# Altium project Test6502_project.PrjPcb
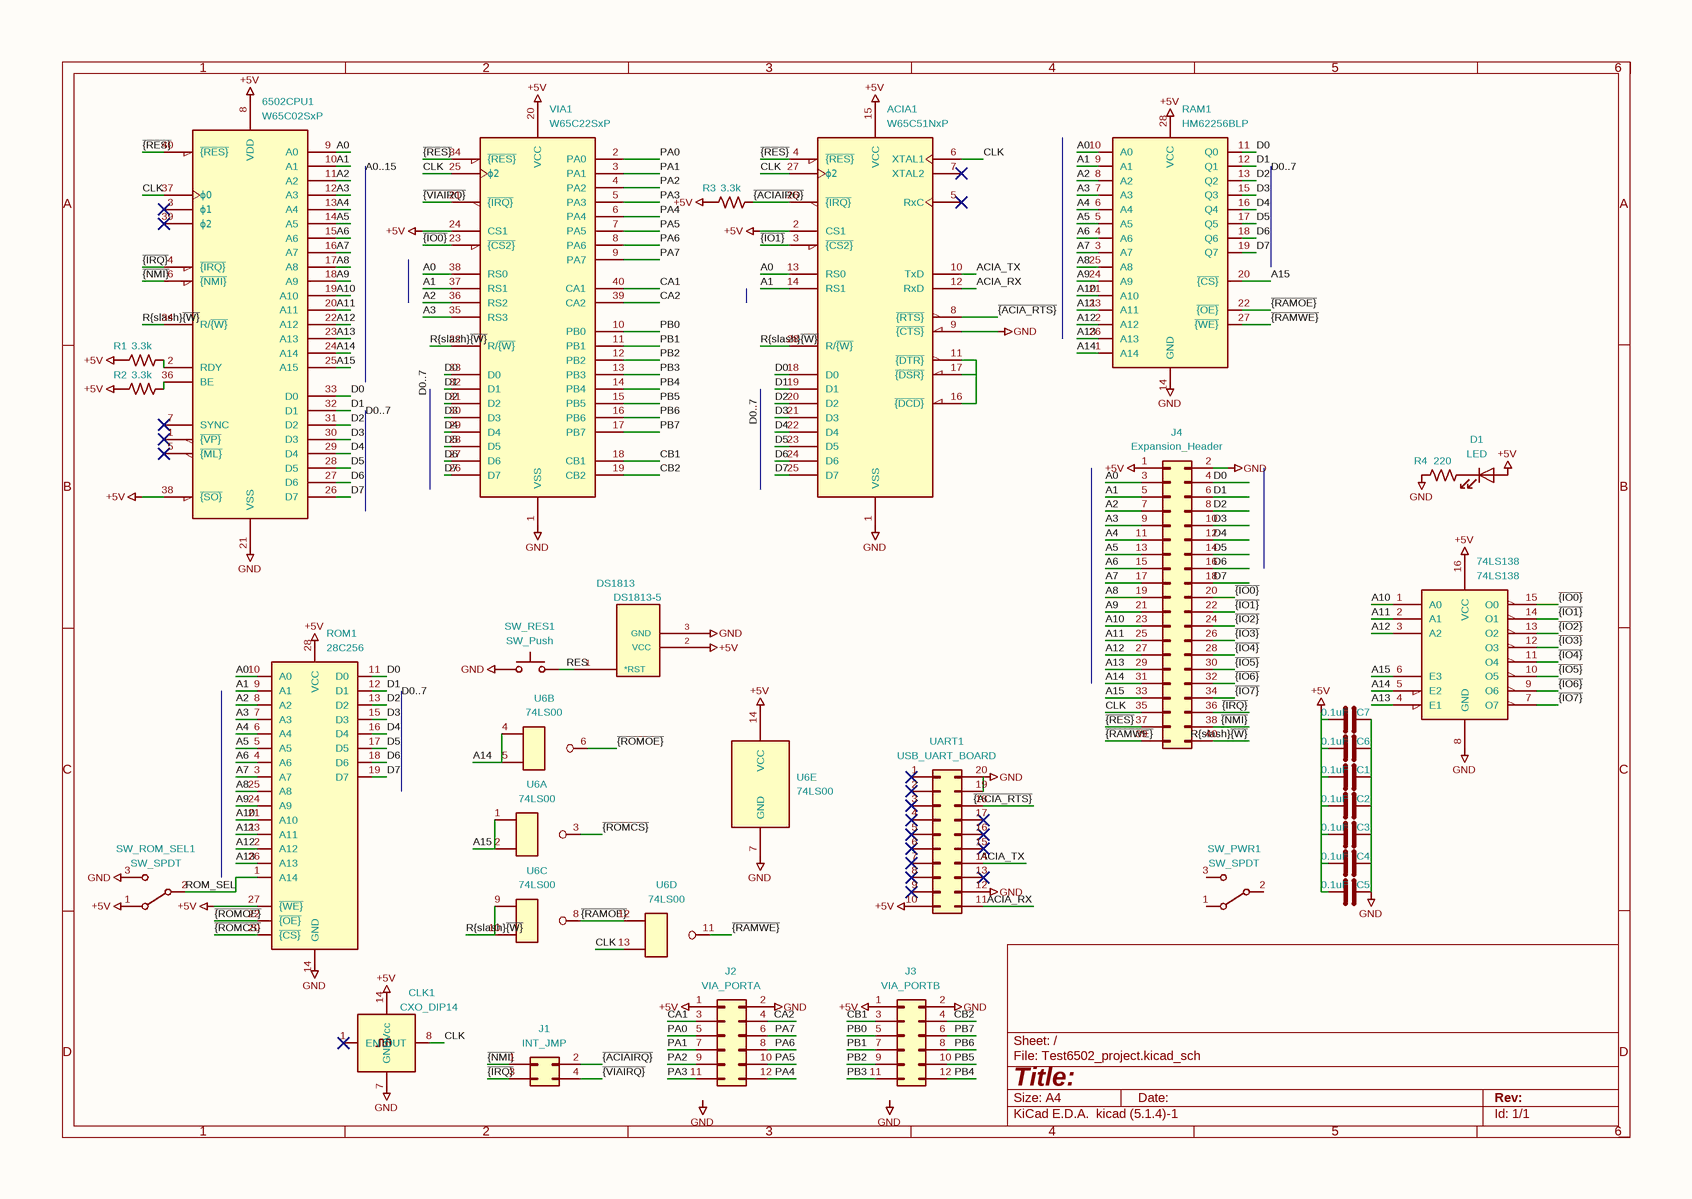
[diagram p0: Test6502_project.SchDoc]
1 sheet, 29 parts. Net scope: global (net labels, ports and power ports of the same name join across sheets).
Board files: Test6502_project.PcbDoc, Test6502_project(1).PcbDoc, Test6502_project_attempt_1.PcbDoc, Test6502_project_attempt_1(1).PcbDoc

## Sheet Test6502_project.SchDoc
size 297 x 209 mm

### Parts
74LS138  74LS138  [DIP-16_W7.62mm]
6502CPU1  W65C02SxP  [DIP-40_W15.24mm_Socket]
ACIA1  W65C51NxP  [DIP-28_W15.24mm_Socket]
C1  0.1uF  [C_Disc_D5.0mm_W2.5mm_P2.50mm]
C2  0.1uF  [C_Disc_D5.0mm_W2.5mm_P2.50mm]
C3  0.1uF  [C_Disc_D5.0mm_W2.5mm_P2.50mm]
C4  0.1uF  [C_Disc_D5.0mm_W2.5mm_P2.50mm]
C5  0.1uF  [C_Disc_D5.0mm_W2.5mm_P2.50mm]
C6  0.1uF  [C_Disc_D5.0mm_W2.5mm_P2.50mm]
C7  0.1uF  [C_Disc_D5.0mm_W2.5mm_P2.50mm]
CLK1  CXO_DIP14  [Oscillator_DIP-14]
D1  LED  [LED_D3.0mm]
DS1813  DS1813-5  [21-0248A]
J1  INT_JMP  [PinHeader_2x02_P2.54mm_Vertical]
J2  VIA_PORTA  [PinHeader_2x06_P2.54mm_Vertical]
J3  VIA_PORTB  [PinHeader_2x06_P2.54mm_Vertical]
J4  Expansion_Header  [PinHeader_2x20_P2.54mm_Vertical]
R1  3.3k  [R_Axial_DIN0207_L6.3mm_D2.5mm_P7.62mm_Horizontal]
R2  3.3k  [R_Axial_DIN0207_L6.3mm_D2.5mm_P7.62mm_Horizontal]
R3  3.3k  [R_Axial_DIN0207_L6.3mm_D2.5mm_P7.62mm_Horizontal]
R4  220  [R_Axial_DIN0207_L6.3mm_D2.5mm_P7.62mm_Horizontal]
RAM1  HM62256BLP  [DIP-28_W15.24mm_Socket]
ROM1  28C256  [DIP-28_W15.24mm_Socket]
SW_PWR1  SW_SPDT  [SW_THT_DPDT]
SW_RES1  SW_Push  [SW_PUSH_6mm]
SW_ROM_SEL1  SW_SPDT  [SW_THT_DPDT]
U6  74LS00  [DIP-14_W7.62mm]  (parts A,B,C,D,E of 5)
UART1  USB_UART_BOARD  [DIP-20_W15.24mm_UART]
VIA1  W65C22SxP  [DIP-40_W15.24mm_Socket]

### Nets
+5V: 74LS138.16(VCC) 6502CPU1.8(VDD) 6502CPU1.38(~{{SO}}) ACIA1.2(CS1) ACIA1.15(VCC) C1.1 C2.1 C3.1 C4.1 C5.1 C6.1 C7.1 CLK1.14(Vcc) D1.2(A) DS1813.2(VCC) J2.1(Pin_1) J3.1(Pin_1) J4.1(Pin_1) R1.1 R2.1 R3.1 RAM1.28(VCC) ROM1.27(~{{WE}}) ROM1.28(VCC) SW_ROM_SEL1.1(A) U6.14(VCC) UART1.10(Pin_10) VIA1.20(VCC) VIA1.24(CS1)
GND: 74LS138.8(GND) 6502CPU1.21(VSS) ACIA1.1(VSS) ACIA1.9(~{{CTS}}) C1.2 C2.2 C3.2 C4.2 C5.2 C6.2 C7.2 CLK1.7(GND) DS1813.3(GND) J2.2(Pin_2) J3.2(Pin_2) J4.2(Pin_2) R4.1 RAM1.14(GND) ROM1.14(GND) SW_RES1.1 SW_ROM_SEL1.3(C) U6.7(GND) UART1.12(Pin_12) UART1.19(Pin_19) UART1.20(Pin_20) VIA1.1(VSS)
A0: 6502CPU1.9(A0) ACIA1.13(RS0) J4.3(Pin_3) RAM1.10(A0) ROM1.10(A0) VIA1.38(RS0)
A1: 6502CPU1.10(A1) ACIA1.14(RS1) J4.5(Pin_5) RAM1.9(A1) ROM1.9(A1) VIA1.37(RS1)
A2: 6502CPU1.11(A2) J4.7(Pin_7) RAM1.8(A2) ROM1.8(A2) VIA1.36(RS2)
A3: 6502CPU1.12(A3) J4.9(Pin_9) RAM1.7(A3) ROM1.7(A3) VIA1.35(RS3)
A4: 6502CPU1.13(A4) J4.11(Pin_11) RAM1.6(A4) ROM1.6(A4)
A5: 6502CPU1.14(A5) J4.13(Pin_13) RAM1.5(A5) ROM1.5(A5)
A6: 6502CPU1.15(A6) J4.15(Pin_15) RAM1.4(A6) ROM1.4(A6)
A7: 6502CPU1.16(A7) J4.17(Pin_17) RAM1.3(A7) ROM1.3(A7)
A8: 6502CPU1.17(A8) J4.19(Pin_19) RAM1.25(A8) ROM1.25(A8)
A9: 6502CPU1.18(A9) J4.21(Pin_21) RAM1.24(A9) ROM1.24(A9)
A10: 74LS138.1(A0) 6502CPU1.19(A10) J4.23(Pin_23) RAM1.21(A10) ROM1.21(A10)
A11: 74LS138.2(A1) 6502CPU1.20(A11) J4.25(Pin_25) RAM1.23(A11) ROM1.23(A11)
A12: 74LS138.3(A2) 6502CPU1.22(A12) J4.27(Pin_27) RAM1.2(A12) ROM1.2(A12)
A13: 74LS138.4(E1) 6502CPU1.23(A13) J4.29(Pin_29) RAM1.26(A13) ROM1.26(A13)
A14: 74LS138.5(E2) 6502CPU1.24(A14) J4.31(Pin_31) RAM1.1(A14) U6.4 U6.5
A15: 74LS138.6(E3) 6502CPU1.25(A15) J4.33(Pin_33) RAM1.20(~{{CS}}) U6.1 U6.2
ACIA_RX: ACIA1.12(RxD) UART1.11(Pin_11)
ACIA_TX: ACIA1.10(TxD) UART1.14(Pin_14)
CA1: J2.3(Pin_3) VIA1.40(CA1)
CA2: J2.4(Pin_4) VIA1.39(CA2)
CB1: J3.3(Pin_3) VIA1.18(CB1)
CB2: J3.4(Pin_4) VIA1.19(CB2)
CLK: 6502CPU1.37(ϕ0) ACIA1.6(XTAL1) ACIA1.27(ϕ2) CLK1.8(OUT) J4.35(Pin_35) U6.13 VIA1.25(ϕ2)
D0: 6502CPU1.33(D0) ACIA1.18(D0) J4.4(Pin_4) RAM1.11(Q0) ROM1.11(D0) VIA1.33(D0)
D1: 6502CPU1.32(D1) ACIA1.19(D1) J4.6(Pin_6) RAM1.12(Q1) ROM1.12(D1) VIA1.32(D1)
D2: 6502CPU1.31(D2) ACIA1.20(D2) J4.8(Pin_8) RAM1.13(Q2) ROM1.13(D2) VIA1.31(D2)
D3: 6502CPU1.30(D3) ACIA1.21(D3) J4.10(Pin_10) RAM1.15(Q3) ROM1.15(D3) VIA1.30(D3)
D4: 6502CPU1.29(D4) ACIA1.22(D4) J4.12(Pin_12) RAM1.16(Q4) ROM1.16(D4) VIA1.29(D4)
D5: 6502CPU1.28(D5) ACIA1.23(D5) J4.14(Pin_14) RAM1.17(Q5) ROM1.17(D5) VIA1.28(D5)
D6: 6502CPU1.27(D6) ACIA1.24(D6) J4.16(Pin_16) RAM1.18(Q6) ROM1.18(D6) VIA1.27(D6)
D7: 6502CPU1.26(D7) ACIA1.25(D7) J4.18(Pin_18) RAM1.19(Q7) ROM1.19(D7) VIA1.26(D7)
PA0: J2.5(Pin_5) VIA1.2(PA0)
PA1: J2.7(Pin_7) VIA1.3(PA1)
PA2: J2.9(Pin_9) VIA1.4(PA2)
PA3: J2.11(Pin_11) VIA1.5(PA3)
PA4: J2.12(Pin_12) VIA1.6(PA4)
PA5: J2.10(Pin_10) VIA1.7(PA5)
PA6: J2.8(Pin_8) VIA1.8(PA6)
PA7: J2.6(Pin_6) VIA1.9(PA7)
PB0: J3.5(Pin_5) VIA1.10(PB0)
PB1: J3.7(Pin_7) VIA1.11(PB1)
PB2: J3.9(Pin_9) VIA1.12(PB2)
PB3: J3.11(Pin_11) VIA1.13(PB3)
PB4: J3.12(Pin_12) VIA1.14(PB4)
PB5: J3.10(Pin_10) VIA1.15(PB5)
PB6: J3.8(Pin_8) VIA1.16(PB6)
PB7: J3.6(Pin_6) VIA1.17(PB7)
RES: DS1813.1(*RST) SW_RES1.2
ROM_SEL: ROM1.1(A14) SW_ROM_SEL1.2(B)
R{slash}~{{W}}: 6502CPU1.34(R/~{{W}}) ACIA1.28(R/~{{W}}) J4.40(Pin_40) U6.9 U6.10 VIA1.22(R/~{{W}})
~{{ACIA_RTS}}: ACIA1.8(~{{RTS}}) UART1.18(Pin_18)
~{{ACIAIRQ}}: ACIA1.26(~{{IRQ}}) J1.2(Pin_2) R3.2
~{{IO0}}: 74LS138.15(O0) J4.20(Pin_20) VIA1.23(~{{CS2}})
~{{IO1}}: 74LS138.14(O1) ACIA1.3(~{{CS2}}) J4.22(Pin_22)
~{{IO2}}: 74LS138.13(O2) J4.24(Pin_24)
~{{IO3}}: 74LS138.12(O3) J4.26(Pin_26)
~{{IO4}}: 74LS138.11(O4) J4.28(Pin_28)
~{{IO5}}: 74LS138.10(O5) J4.30(Pin_30)
~{{IO6}}: 74LS138.9(O6) J4.32(Pin_32)
~{{IO7}}: 74LS138.7(O7) J4.34(Pin_34)
~{{IRQ}}: 6502CPU1.4(~{{IRQ}}) J1.3(Pin_3) J4.36(Pin_36)
~{{NMI}}: 6502CPU1.6(~{{NMI}}) J1.1(Pin_1) J4.38(Pin_38)
~{{RAMOE}}: RAM1.22(~{{OE}}) U6.8 U6.12
~{{RAMWE}}: J4.39(Pin_39) RAM1.27(~{{WE}}) U6.11
~{{RES}}: 6502CPU1.40(~{{RES}}) ACIA1.4(~{{RES}}) J4.37(Pin_37) VIA1.34(~{{RES}})
~{{ROMCS}}: ROM1.20(~{{CS}}) U6.3
~{{ROMOE}}: ROM1.22(~{{OE}}) U6.6
~{{VIAIRQ}}: J1.4(Pin_4) VIA1.21(~{{IRQ}})
Net6502CPU1_2: 6502CPU1.2(RDY) R1.2
Net6502CPU1_36: 6502CPU1.36(BE) R2.2
NetACIA1_11: ACIA1.11(~{{DTR}}) ACIA1.16(~{{DCD}}) ACIA1.17(~{{DSR}})
NetD1_1: D1.1(K) R4.2

Not connected (* = marked no-connect by the designer): 6502CPU1 1(~{{VP}})* 3(ϕ1)* 5(~{{ML}})* 7(SYNC)* 35(nc) 39(ϕ2)*; ACIA1 5(RxC)* 7(XTAL2)*; CLK1 1(EN)*; SW_PWR1 1(A) 2(B) 3(C); UART1 1(Pin_1)* 2(Pin_2)* 3(Pin_3)* 4(Pin_4)* 5(Pin_5)* 6(Pin_6)* 7(Pin_7)* 8(Pin_8)* 9(Pin_9)* 13(Pin_13)* 15(Pin_15)* 16(Pin_16)* 17(Pin_17)*

### Buses and harness runs
bus A0..15
bus D0..7

### Notes on the sheet
- Labels drawn without touching a wire or pin: GND
- 1
- 2
- 3
- 4
- 5
- 6
- A
- B
- C
- D
- Title:
- File: Test6502_project.kicad_sch
- Sheet: /
- KiCad E.D.A.  kicad (5.1.4)-1
- Size: A4
- Date:
- Rev:
- Id: 1/1

### Library data of the parts
C1-C7 = C: Value: 0.1uF; Footprint: Capacitor_THT:C_Disc_D5.0mm_W2.5mm_P2.50mm
DS1813 = DS1813-5: MANUFACTURER_PART_NUMBER: ds18135+; VENDOR: MAXIM; Value: DS1813-5; Footprint: DS1813-5:21-0248A
J1 = Conn_02x02_Odd_Even: Value: INT_JMP; Footprint: Connector_PinHeader_2.54mm:PinHeader_2x02_P2.54mm_Vertical
J2 J3 = Conn_02x06_Odd_Even: Footprint: Connector_PinHeader_2.54mm:PinHeader_2x06_P2.54mm_Vertical
  J2: Value: VIA_PORTA
  J3: Value: VIA_PORTB
J4 = Conn_02x20_Odd_Even: Value: Expansion_Header; Footprint: Connector_PinHeader_2.54mm:PinHeader_2x20_P2.54mm_Vertical
R1-R4 = R_US: Footprint: Resistor_THT:R_Axial_DIN0207_L6.3mm_D2.5mm_P7.62mm_Horizontal
  R1-R3: Value: 3.3k
  R4: Value: 220
UART1 = Conn_02x10_Counter_Clockwise: Value: USB_UART_BOARD; Footprint: SW_THT_DPDT:DIP-20_W15.24mm_UART
74LS138 = 74LS138: Value: 74LS138; Footprint: Package_DIP:DIP-16_W7.62mm
6502CPU1 = W65C02SxP: Value: W65C02SxP; Footprint: Package_DIP:DIP-40_W15.24mm_Socket
ACIA1 = W65C51NxP: Value: W65C51NxP; Footprint: Package_DIP:DIP-28_W15.24mm_Socket
CLK1 = CXO_DIP14: Value: CXO_DIP14; Footprint: Oscillator:Oscillator_DIP-14
D1 = LED: Value: LED; Footprint: LED_THT:LED_D3.0mm
RAM1 = HM62256BLP: Value: HM62256BLP; Footprint: Package_DIP:DIP-28_W15.24mm_Socket
ROM1 = 28C256: Value: 28C256; Footprint: Package_DIP:DIP-28_W15.24mm_Socket
SW_PWR1 SW_ROM_SEL1 = SW_SPDT: Value: SW_SPDT; Footprint: SW_THT_DPDT:SW_THT_DPDT
SW_RES1 = SW_Push: Value: SW_Push; Footprint: Button_Switch_THT:SW_PUSH_6mm
U6 = 74LS00: Value: 74LS00; Footprint: Package_DIP:DIP-14_W7.62mm
VIA1 = W65C22SxP: Value: W65C22SxP; Footprint: Package_DIP:DIP-40_W15.24mm_Socket